# EAGLE schematic BPMLabLineRX3.1 (EAGLE 7.5.0)
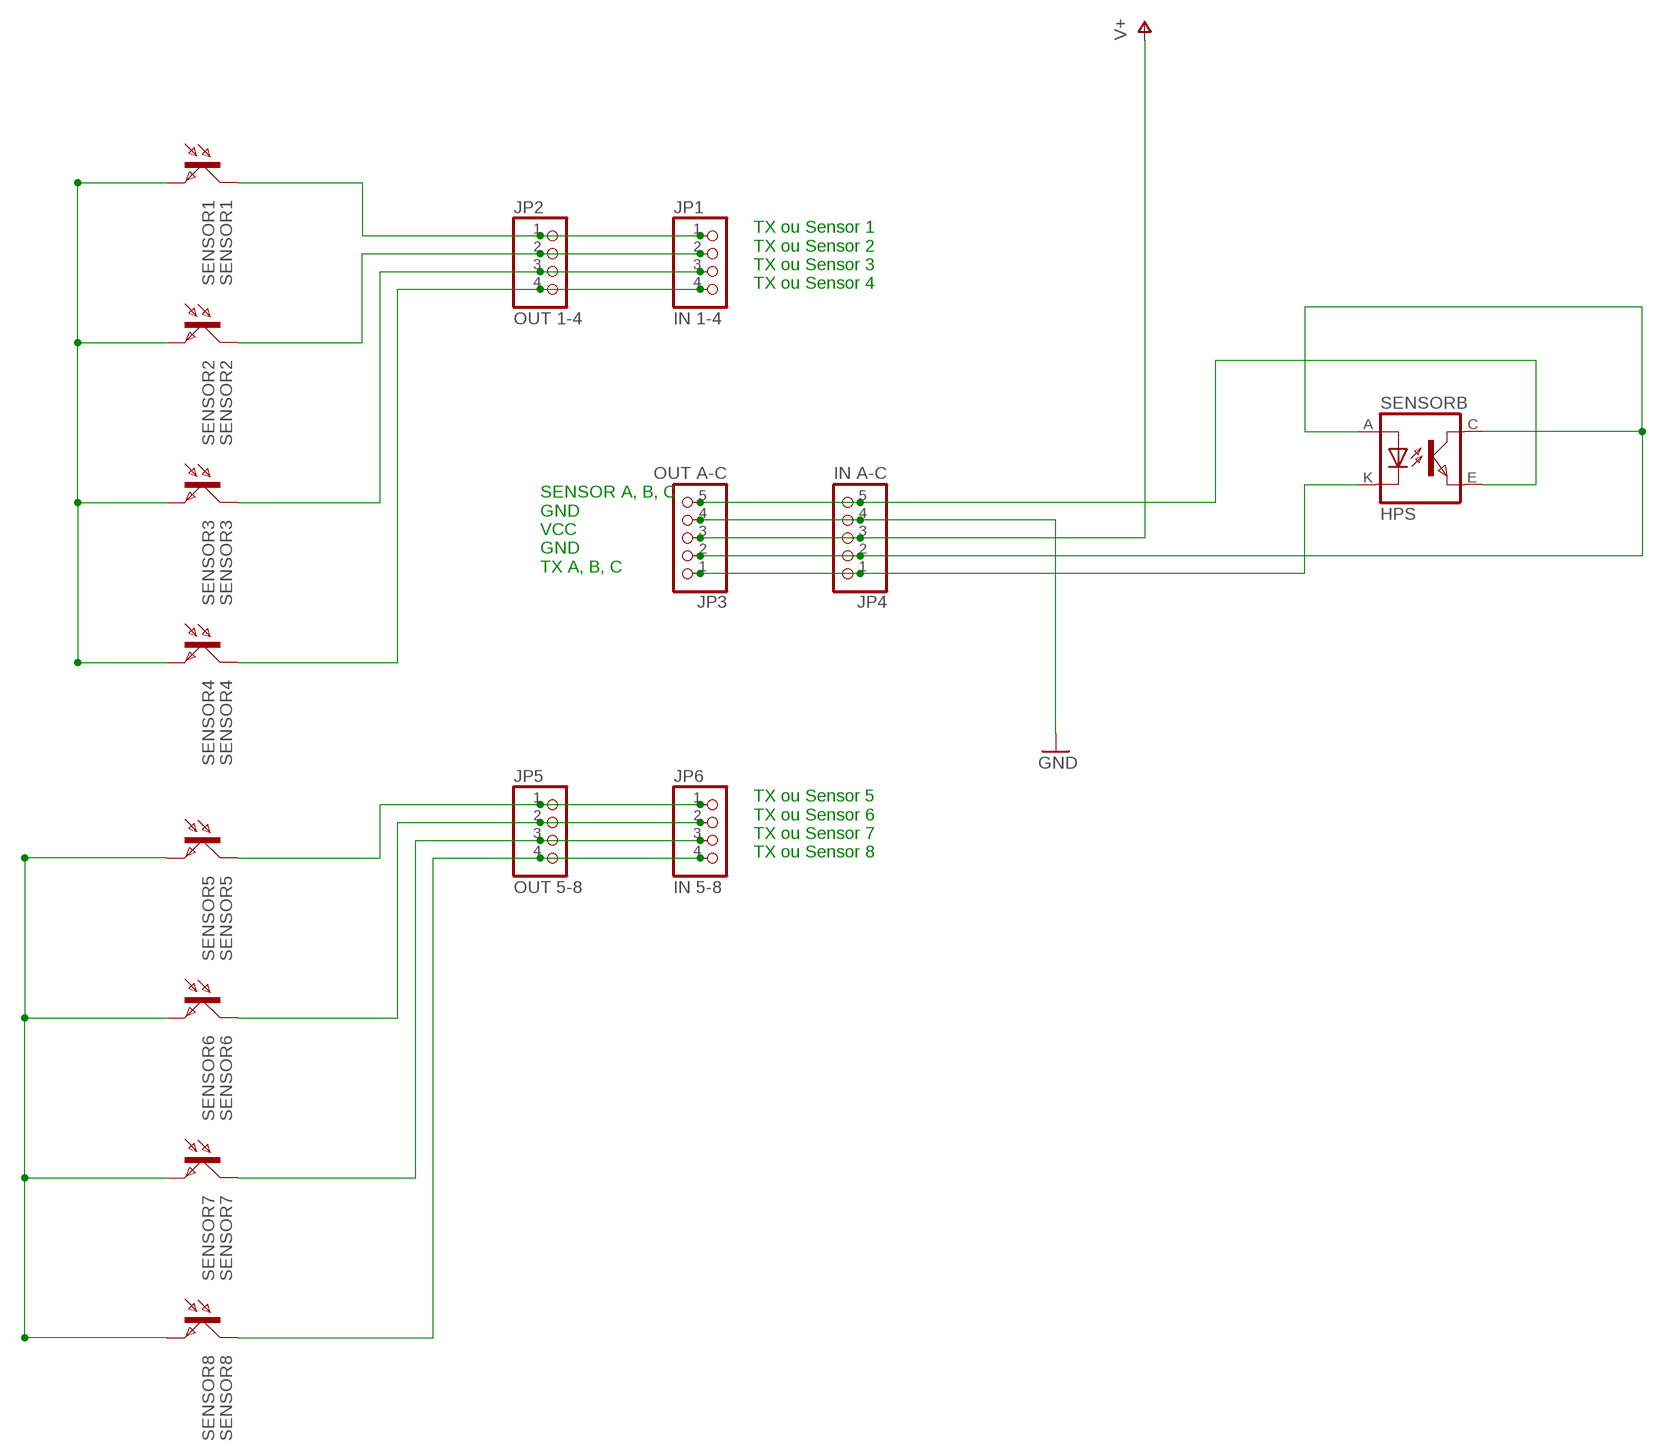
[diagram p0: schematic, sheet 1]

## Parts
JP1  IN 1-4  PINHD-1X4  [1X04]
JP2  OUT 1-4  PINHD-1X4  [1X04]
JP3  OUT A-C  PINHD-1X5  [1X05]
JP4  IN A-C  PINHD-1X5  [1X05]
JP5  OUT 5-8  PINHD-1X4  [1X04]
JP6  IN 5-8  PINHD-1X4  [1X04]
SENSOR1  SENSOR1  BPX81  [BPX81]
SENSOR2  SENSOR2  BPX81  [BPX81]
SENSOR3  SENSOR3  BPX81  [BPX81]
SENSOR4  SENSOR4  BPX81  [BPX81]
SENSOR5  SENSOR5  BPX81  [BPX81]
SENSOR6  SENSOR6  BPX81  [BPX81]
SENSOR7  SENSOR7  BPX81  [BPX81]
SENSOR8  SENSOR8  BPX81  [BPX81]
SENSORB  HPS  TCRT5000  [TCRT5000]

## Nets
GND: JP3.4 JP4.4
N$1: JP1.4 JP2.4 SENSOR4.C
N$2: JP5.2 JP6.2 SENSOR6.C
N$3: JP5.3 JP6.3 SENSOR7.C
N$4: JP5.4 JP6.4 SENSOR8.C
N$5: JP1.1 JP2.1 SENSOR1.C
N$6: JP1.2 JP2.2 SENSOR2.C
N$7: JP1.3 JP2.3 SENSOR3.C
N$8: JP5.1 JP6.1 SENSOR5.C
N$9: JP3.5 JP4.5 SENSORB.E(EMITTER)
N$10: JP3.1 JP4.1 SENSORB.K(CATHODE)
N$11: SENSOR1.E SENSOR2.E SENSOR3.E SENSOR4.E
N$12: SENSOR5.E SENSOR6.E SENSOR7.E SENSOR8.E
N$16: JP3.2 JP4.2 SENSORB.A(ANODE) SENSORB.C(COLLECTOR)
V+: JP3.3 JP4.3

## Notes on the sheet
- TX ou Sensor 1
  TX ou Sensor 2
  TX ou Sensor 3
  TX ou Sensor 4
- SENSOR A, B, C
  GND
  VCC
  GND
  TX A, B, C
- TX ou Sensor 5
  TX ou Sensor 6
  TX ou Sensor 7
  TX ou Sensor 8

## Library data of the parts
JP1 JP2 JP5 JP6 = pinhead:PINHD-1X4: PIN HEADER
JP3 JP4 = pinhead:PINHD-1X5: PIN HEADER
SENSOR1-SENSOR8 = opto-trans-siemens:BPX81: PHOTO TRANSISTOR; OC_FARNELL: unknown; OC_NEWARK: unknown
SENSORB = tcrt5000:TCRT5000